# Altium project paid_training.PrjPcb (part 3 of 3)
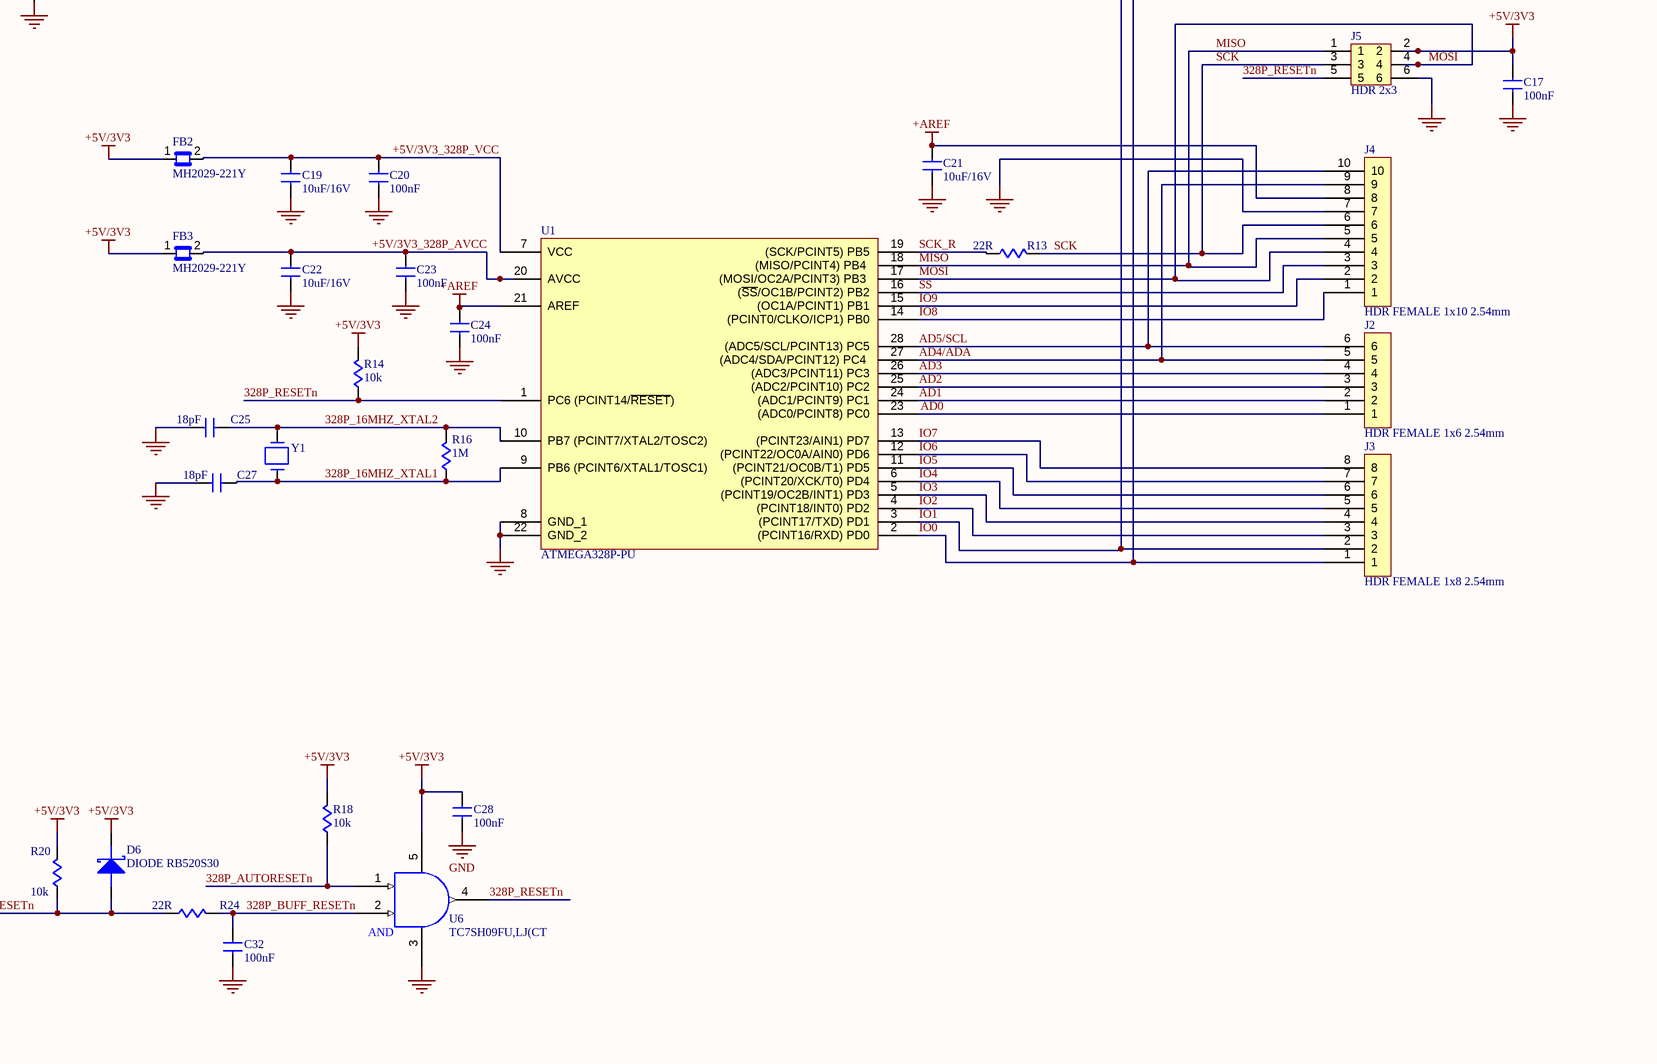
[diagram p5: 28Pins_Schematic.SchDoc, bottom right]

## Sheet 28Pins_Schematic.SchDoc: 28Pins (continued)

### Library data of the parts (continued)
R10-R12 = RC0805FR-071KL: RES SMD 1K OHM 1% 1/8W 0805; Manufacturer: Yageo; Resistance: 1kR; Temperature Coefficient: 100ppm/°C; Voltage Rating (DC): 150V; Power Rating: 125mW; Supplier 1: Digi-Key; Supplier Part Number 1: 311-1.00KCRCT-ND; Manufacturer Part Number: RC0805FR-071KL; RoHS: Yes; Category: Chip SMD Resistors; Stock 1: 7996583; Pricing 1: 1=0.10000, 10=0.04200, 100=0.01690, 1000=0.00759, 2500=0.00659 (USD); Case/Package: 0805; Number of Pins: 2; Case Code (Metric): 2012; Case Code (Imperial): 0805; Size Code: 0805; Min Operating Temperature: -55°C; Max Operating Temperature: 155°C; Tolerance: 1%; Resistor Type: Thick Film; Packaging: Tape and Reel; Package Quantity: 1; Voltage Rating: 150V; Number of Terminations: 2; Termination: SMD/SMT; Max Power Dissipation: 125mW; Features: Moisture Resistant; Series: RC; Resistance Tolerance: 1%; Construction: Rectangular; Length: 0.079inch; Width: 0.049inch; Height: 0.024inch; Depth: 1.25mm; REACH SVHC: Unknown; Lead Free: Lead Free; RoHS Compliant: Yes; Military Standard: Not; ComponentLink1URL: https://datasheet.ciiva.com/46385/444164-46385020.pdf?src-supplier=Element14; ComponentLink1Description: https://datasheet.ciiva.com/46385/444164-46385020.pdf?src-supplier=Element14; ComponentLink2URL: https://datasheet.ciiva.com/2456/pyu-r-int-thick-7-2456975.pdf?src-supplier=Digi-Key; ComponentLink2Description: https://datasheet.ciiva.com/2456/pyu-r-int-thick-7-2456975.pdf?src-supplier=Digi-Key; ComponentLink3URL: https://datasheet.ciiva.com/2456/pyu-r-int-thick-7-2456976.pdf?src-supplier=Digi-Key; ComponentLink3Description: https://datasheet.ciiva.com/2456/pyu-r-int-thick-7-2456976.pdf?src-supplier=Digi-Key; ComponentLink4URL: https://datasheet.ciiva.com/2456/pyu-r-int-thick-7-2456977.pdf?src-supplier=Digi-Key; ComponentLink4Description: https://datasheet.ciiva.com/2456/pyu-r-int-thick-7-2456977.pdf?src-supplier=Digi-Key; ComponentLink5URL: https://datasheet.ciiva.com/16850/rc0805-16850409.pdf?src-supplier=Future+Electronics; ComponentLink5Description: https://datasheet.ciiva.com/16850/rc0805-16850409.pdf?src-supplier=Future+Electronics; ComponentLink6URL: https://datasheet.ciiva.com/7941/1686128-7941719.pdf?src-supplier=Element14; ComponentLink6Description: https://datasheet.ciiva.com/7941/1686128-7941719.pdf?src-supplier=Element14
SCKT_FOR_U1 = 4828-6004-CP: Conn DIP Socket SKT 28 POS 2.54mm Solder ST Thru-Hole; Manufacturer: 3M; Number of Contacts: 28; Gender: Female; Current Rating: 1A; Voltage Rating (AC): 100V; Insulation Resistance: 5GR; Row Spacing: 15.24mm; Supplier 1: Digi-Key; Supplier Part Number 1: 3M5481-ND; Manufacturer Part Number: 4828-6004-CP; RoHS: Yes; Category: IC and Component Sockets; Stock 1: 2128; Pricing 1: 1=0.84000, 10=0.74300, 25=0.69920, 50=0.67000, 100=0.64080, 250=0.58256, 500=0.52432, 1000=0.46605, 2500=0.42236 (USD); Mount: Through Hole; Contact Material: Bronze; Contact Plating: Tin,Nickel; Housing Material: Polyester; Insulation Material: Polyester; Min Operating Temperature: -25°C; Max Operating Temperature: 85°C; Packaging: Rail/Tube; Number of Rows: 2; Termination: Solder; Orientation: Straight; Package Quantity: 14; Number of Positions: 28; Connector Type: DIP; Series: 4800; Contact Type: Type D; Length: 35.43mm; Width: 17.78mm; Pitch: 2.54mm; Depth: 17.78mm; Radiation Hardening: No; Lead Free: Lead Free; Flammability Rating: UL94 V-0; ComponentLink1URL: https://datasheet.ciiva.com/15188/getdatasheetpartid-335067-15188348.pdf?src-supplier=Verical; ComponentLink1Description: https://datasheet.ciiva.com/15188/getdatasheetpartid-335067-15188348.pdf?src-supplier=Verical; ComponentLink2URL: https://datasheet.ciiva.com/768/ts1099-768368.pdf?src-supplier=Digi-Key; ComponentLink2Description: https://datasheet.ciiva.com/768/ts1099-768368.pdf?src-supplier=Digi-Key; ComponentLink3URL: https://datasheet.ciiva.com/8006/ts1099-8006727.pdf?src-supplier=Element14; ComponentLink3Description: https://datasheet.ciiva.com/8006/ts1099-8006727.pdf?src-supplier=Element14
SW1 SW2 = TL1105AF160Q: Switch Tactile N.O. SPST Round Button PC Pins 0.05A 50VDC 1.57N Thru-Hole; Manufacturer: E-Switch; Mechanical Life: 100000Cycles; Actuator Material: Nylon,Polyamide; Operating Force: 160gf; Voltage Rating (DC): 12V; Contact Resistance: 100mR; Current Rating: 50mA; Max Voltage Rating (DC): 50V; Illumination Type: Non-Illuminated,Illuminated; Switch Travel: 0.25mm; Switch Function: Off-Mom; Actuator Type: Standard; Actuator Length: 1.4mm; Supplier 1: Digi-Key; Supplier Part Number 1: EG1829-ND; Manufacturer Part Number: TL1105AF160Q; RoHS: Yes; Category: Tactile Switches; Stock 1: 11469; Pricing 1: 1=0.25000, 10=0.24600, 25=0.23320, 100=0.21130, 250=0.19260, 500=0.17902, 1000=0.15271, 2500=0.14847, 5000=0.13999 (USD); Mount: Through Hole; Contact Material: Silver,Bronze; Color: Black; Contact Plating: Silver; Housing Material: Nylon; Min Operating Temperature: -20°C; Max Operating Temperature: 70°C; Package Quantity: 750; Packaging: Bulk; Termination: PC Pin; Throw Configuration: SPST; Electrical Life: 100000Cycles; Orientation: Straight; Contact Current Rating: 50mA; Series: TL1105; Length: 6mm; Width: 6mm; Size: 6mm; REACH SVHC: No SVHC; Lead Free: Lead Free; RoHS Compliant: Yes; ComponentLink1URL: https://datasheet.ciiva.com/16156/p010002-16156245.pdf?src-supplier=Onlinecomponents.com; ComponentLink1Description: https://datasheet.ciiva.com/16156/p010002-16156245.pdf?src-supplier=Onlinecomponents.com; ComponentLink2URL: https://datasheet.ciiva.com/1701/tl1105-1701408.pdf?src-supplier=Newark; ComponentLink2Description: https://datasheet.ciiva.com/1701/tl1105-1701408.pdf?src-supplier=Newark; ComponentLink3URL: https://datasheet.ciiva.com/2900/tl1105-2900854.pdf?src-supplier=Digi-Key; ComponentLink3Description: https://datasheet.ciiva.com/2900/tl1105-2900854.pdf?src-supplier=Digi-Key
U1 = ATMEGA328P-PU: IC MCU 8BIT 32KB FLASH 28DIP; Manufacturer: Microchip / Atmel; Core Architecture: AVR; RAM Size: 2KB; Number of PWM Channels: 6; Number of Timers/Counters: 3; Min Supply Voltage: 1.8V; Max Supply Voltage: 5.5V; Interface: I2C,SPI,UART,USART,2-Wire; Number of I/Os: 23; Frequency: 20MHz; Oscillator Type: Internal; Data Bus Width: 8b; Number of SPI Channels: 1; Watchdog Timer: Yes; Peripherals: Brown-out Detect/Reset,POR,PWM,WDT; Supplier 1: Digi-Key; Supplier Part Number 1: ATMEGA328P-PU-ND; Manufacturer Part Number: ATMEGA328P-PU; RoHS: Yes; Category: Microcontrollers; Stock 1: 49556; Pricing 1: 1=2.52000, 25=2.31000, 100=2.09000 (USD); Mount: Through Hole; Case/Package: PDIP; Number of Pins: 28; Contact Plating: Tin,Matte; Min Operating Temperature: -40°C; Max Operating Temperature: 85°C; Package Quantity: 14; Series: AVR® ATmega; Number of ADC Channels: 6; Packaging: Rail/Tube; Number of Programmable I/O: 23; Max Frequency: 20MHz; Number of I2C Channels: 1; Memory Type: FLASH; Memory Size: 32KB; Length: 37.4mm; Width: 6.76mm; Height: 3.28mm; Radiation Hardening: No; REACH SVHC: No SVHC; Lead Free: Lead Free; RoHS Compliant: Yes; ComponentLink1URL: https://datasheet.ciiva.com/19457/2139111-19457070.pdf?src-supplier=Jameco; ComponentLink1Description: https://datasheet.ciiva.com/19457/2139111-19457070.pdf?src-supplier=Jameco; ComponentLink2URL: https://datasheet.ciiva.com/1157/1684409-1157696.pdf?src-supplier=Element14; ComponentLink2Description: https://datasheet.ciiva.com/1157/1684409-1157696.pdf?src-supplier=Element14; ComponentLink3URL: https://datasheet.ciiva.com/20168/73-4283-20168380.pdf?src-supplier=Rapid+Electronics; ComponentLink3Description: https://datasheet.ciiva.com/20168/73-4283-20168380.pdf?src-supplier=Rapid+Electronics; ComponentLink4URL: https://datasheet.ciiva.com/29119/155197-da-01-en-microcontr-atmega328p-pu-8bit-pdip-28-29119593.pdf?src-supplier=Conrad; ComponentLink4Description: https://datasheet.ciiva.com/29119/155197-da-01-en-microcontr-atmega328p-pu-8bit-pdip-28-29119593.pdf?src-supplier=Conrad; ComponentLink5URL: https://datasheet.ciiva.com/26818/atmega328p-pu-26818578.pdf?src-supplier=IIIC; ComponentLink5Description: https://datasheet.ciiva.com/26818/atmega328p-pu-26818578.pdf?src-supplier=IIIC; ComponentLink6URL: https://datasheet.ciiva.com/15213/getdatasheetpartid-318533-15213133.pdf?src-supplier=Verical; ComponentLink6Description: https://datasheet.ciiva.com/15213/getdatasheetpartid-318533-15213133.pdf?src-supplier=Verical
U2 = ATMEGA16U2-AUR: IC MCU 8BIT 16KB FLASH 32TQFP; Manufacturer: Microchip / Atmel; Core Architecture: AVR; Frequency: 16MHz; Interface: SPI,USB,USART; Data Bus Width: 8b; RAM Size: 512B; Max Supply Voltage: 5.5V; Min Supply Voltage: 2.7V; Number of Timers/Counters: 2; Number of Programmable I/O: 22; Watchdog Timer: Yes; Supplier 1: Digi-Key; Supplier Part Number 1: ATMEGA16U2-AURCT-ND; Manufacturer Part Number: ATMEGA16U2-AUR; RoHS: Yes; Category: Microcontrollers; Stock 1: 1113; Pricing 1: 1=2.92000, 25=2.67320, 100=2.40900 (USD); Mount: Surface Mount; Case/Package: LQFP; Number of Pins: 32; Contact Plating: Tin,Matte; Min Operating Temperature: -40°C; Max Operating Temperature: 85°C; Package Quantity: 2000; Packaging: Tape and Reel; Memory Type: FLASH; Memory Size: 16KB; Max Frequency: 16MHz; RoHS Compliant: Yes; ComponentLink1URL: https://datasheet.ciiva.com/9234/doc7799-9234702.pdf?src-supplier=Avnet; ComponentLink1Description: https://datasheet.ciiva.com/9234/doc7799-9234702.pdf?src-supplier=Avnet
U3 = TL1963A-33DCQR: IC REG LINEAR 3.3V 1.5A SOT223-6; Manufacturer: Texas Instruments; Dropout Voltage: 340mV; Number of Outputs: 1; Max Input Voltage: 20V; Min Input Voltage: 2.1V; Min Current Limit: 1.6A; Input Bias Current: 1mA; Polarity: Positive; Accuracy: 3%; Output Type: Fixed; Supplier 1: Digi-Key; Supplier Part Number 1: 296-24534-1-ND; Manufacturer Part Number: TL1963A-33DCQR; RoHS: Yes; Category: Voltage Regulators - Linear; Stock 1: 3245; Pricing 1: 1=3.26000, 10=2.93100, 25=2.77120, 100=2.40190, 250=2.27868, 500=2.04466, 1000=1.94054 (USD); Case/Package: SOT-223; Number of Pins: 6; Contact Plating: Gold; Min Operating Temperature: -40°C; Max Operating Temperature: 125°C; Package Quantity: 1; Packaging: Tape and Reel; Output Voltage: 3.3V; Output Current: 1.5A; Max Output Current: 1.5A; Number of Regulators: 1; Quiescent Current: 1mA; Max Output Voltage: 3.3V; Min Output Voltage: 3.3V; Series: -; Radiation Hardening: No; Lead Free: Lead Free; RoHS Compliant: Yes; ComponentLink1URL: https://datasheet.ciiva.com/2046/tl1963a-2046161.pdf?src-supplier=Digi-Key; ComponentLink1Description: https://datasheet.ciiva.com/2046/tl1963a-2046161.pdf?src-supplier=Digi-Key; ComponentLink2URL: https://datasheet.ciiva.com/2046/tl1963a-2046162.pdf?src-supplier=Digi-Key; ComponentLink2Description: https://datasheet.ciiva.com/2046/tl1963a-2046162.pdf?src-supplier=Digi-Key; ComponentLink3URL: https://datasheet.ciiva.com/2046/tl1963a-2046163.pdf?src-supplier=Digi-Key; ComponentLink3Description: https://datasheet.ciiva.com/2046/tl1963a-2046163.pdf?src-supplier=Digi-Key; ComponentLink4URL: https://datasheet.ciiva.com/26176/tl1963a-25-26176569.pdf?src-supplier=Avnet+Europe; ComponentLink4Description: https://datasheet.ciiva.com/26176/tl1963a-25-26176569.pdf?src-supplier=Avnet+Europe
U4-U7 = TC7SH09FU,LJ(CT: AND Gate 1-Element 2-IN CMOS 5-Pin SSOP; Manufacturer: Toshiba; Number of Circuits: 1; Number of Inputs: 2; Quiescent Current: 2uA; Propagation Delay: 7.5ns; Supplier 1: Digi-Key; Supplier Part Number 1: TC7SH09FULJ(CTCT-ND; Manufacturer Part Number: TC7SH09FU,LJ(CT; RoHS: No; Category: Logic Gates; Stock 1: 3894; Pricing 1: 1=0.34000, 10=0.25400, 25=0.22240, 100=0.14410, 250=0.11924, 500=0.09540, 1000=0.07314 (USD); Mount: Surface Mount; Min Operating Temperature: -40°C; Max Operating Temperature: 85°C; Packaging: Tape and Reel; Logic Function: AND GATE; RoHS Compliant: No; ComponentLink1URL: https://toshiba.semicon-storage.com/info/docget.jsp?did=14449&prodName=TC7SH09FU&src-supplier=Digi-Key; ComponentLink1Description: https://toshiba.semicon-storage.com/info/docget.jsp?did=14449&prodName=TC7SH09FU&src-supplier=Digi-Key; ComponentLink2URL: http://toshiba.semicon-storage.com/info/docget.jsp?type=datasheet&lang=en&pid=TC7SH09F&src-supplier=Avnet; ComponentLink2Description: http://toshiba.semicon-storage.com/info/docget.jsp?type=datasheet&lang=en&pid=TC7SH09F&src-supplier=Avnet; ComponentLink3URL: http://toshiba.semicon-storage.com/info/lookup.jsp?pid=TC7SH09FU&amp;lang=en&src-supplier=Mouser; ComponentLink3Description: http://toshiba.semicon-storage.com/info/lookup.jsp?pid=TC7SH09FU&amp;lang=en&src-supplier=Mouser
Y1 Y2 = ABM7-16.000MHZ-4-T: CRYSTAL 16.0000 MHZ; Manufacturer: Abracon; Frequency Tolerance: 30ppm; Load Capacitance: 18pF; Frequency: 16MHz; Frequency Stability: 50ppm; ESR (Equivalent Series Resistance): 50R; Supplier 1: Digi-Key; Supplier Part Number 1: 535-13460-2-ND; Manufacturer Part Number: ABM7-16.000MHZ-4-T; RoHS: Yes; Category: Crystals; Stock 1: 1000; Pricing 1: 1000=0.50400 (USD); Mount: Surface Mount; Case/Package: SMD/SMT; Min Operating Temperature: -10°C; Max Operating Temperature: 60°C; Packaging: Tape and Reel; Length: 0.236inch; Width: 0.138inch; Height: 0.055inch; Lead Free: Lead Free; RoHS Compliant: Yes; REACH SVHC: Yes; ComponentLink1URL: https://datasheet.ciiva.com/16411/abm7-16411039.pdf?src-supplier=Future+Electronics; ComponentLink1Description: https://datasheet.ciiva.com/16411/abm7-16411039.pdf?src-supplier=Future+Electronics
Z1 Z2 = CG0603MLC-05LEA: CHIP GUARD; Manufacturer: Bourns; Capacitance: 0.5pF; Operating Supply Voltage: 5V; Number of Channels: 1; Clamping Voltage: 25V; Current Rating: 5nA; Element Configuration: Single; Supplier 1: Digi-Key; Supplier Part Number 1: CG0603MLC-05LEACT-ND; Manufacturer Part Number: CG0603MLC-05LEA; RoHS: Yes; Category: Varistors; Stock 1: 10424; Pricing 1: 1=0.52000, 10=0.40800, 25=0.34400, 100=0.28000, 250=0.23200, 500=0.19200, 1000=0.14400, 2500=0.13200 (USD); Mount: Surface Mount; Case/Package: 0603; Number of Pins: 2; Case Code (Imperial): 0603; Case Code (Metric): 1608; Contact Plating: Tin; Min Operating Temperature: -40°C; Max Operating Temperature: 125°C; Package Quantity: 5000; Voltage Rating (DC): 5V; Packaging: Tape and Reel; Termination: SMD/SMT; Voltage: 5V; Number of Circuits: 1; Max Voltage Rating (DC): 5V; Working Voltage: 5V; Leakage Current: 5nA; Series: ChipGuard®; Length: 1.6mm; Width: 0.8mm; Depth: 0.8mm; Radiation Hardening: No; RoHS Compliant: Yes; ComponentLink1URL: https://datasheet.ciiva.com/4479/mlc-48379-4479520.pdf?src-supplier=Mouser; ComponentLink1Description: https://datasheet.ciiva.com/4479/mlc-48379-4479520.pdf?src-supplier=Mouser; ComponentLink2URL: https://datasheet.ciiva.com/369/mlc-369341.pdf?src-supplier=Digi-Key; ComponentLink2Description: https://datasheet.ciiva.com/369/mlc-369341.pdf?src-supplier=Digi-Key